# Altium schematic sheet Heater_Driver.SchDoc: Heater Driver Soldeerbout
size A4; Date: 18/02/2022; Author: Robbe Th.; CompanyName: R-CyberSolutions; DrawnBy: Robbe Th.; Organization: R-CyberSolutions; DocumentNumber: 1/1; Revision: 1; SheetNumber: 2; SheetTotal: 4; Number: PXL_SEM2_SB02R1
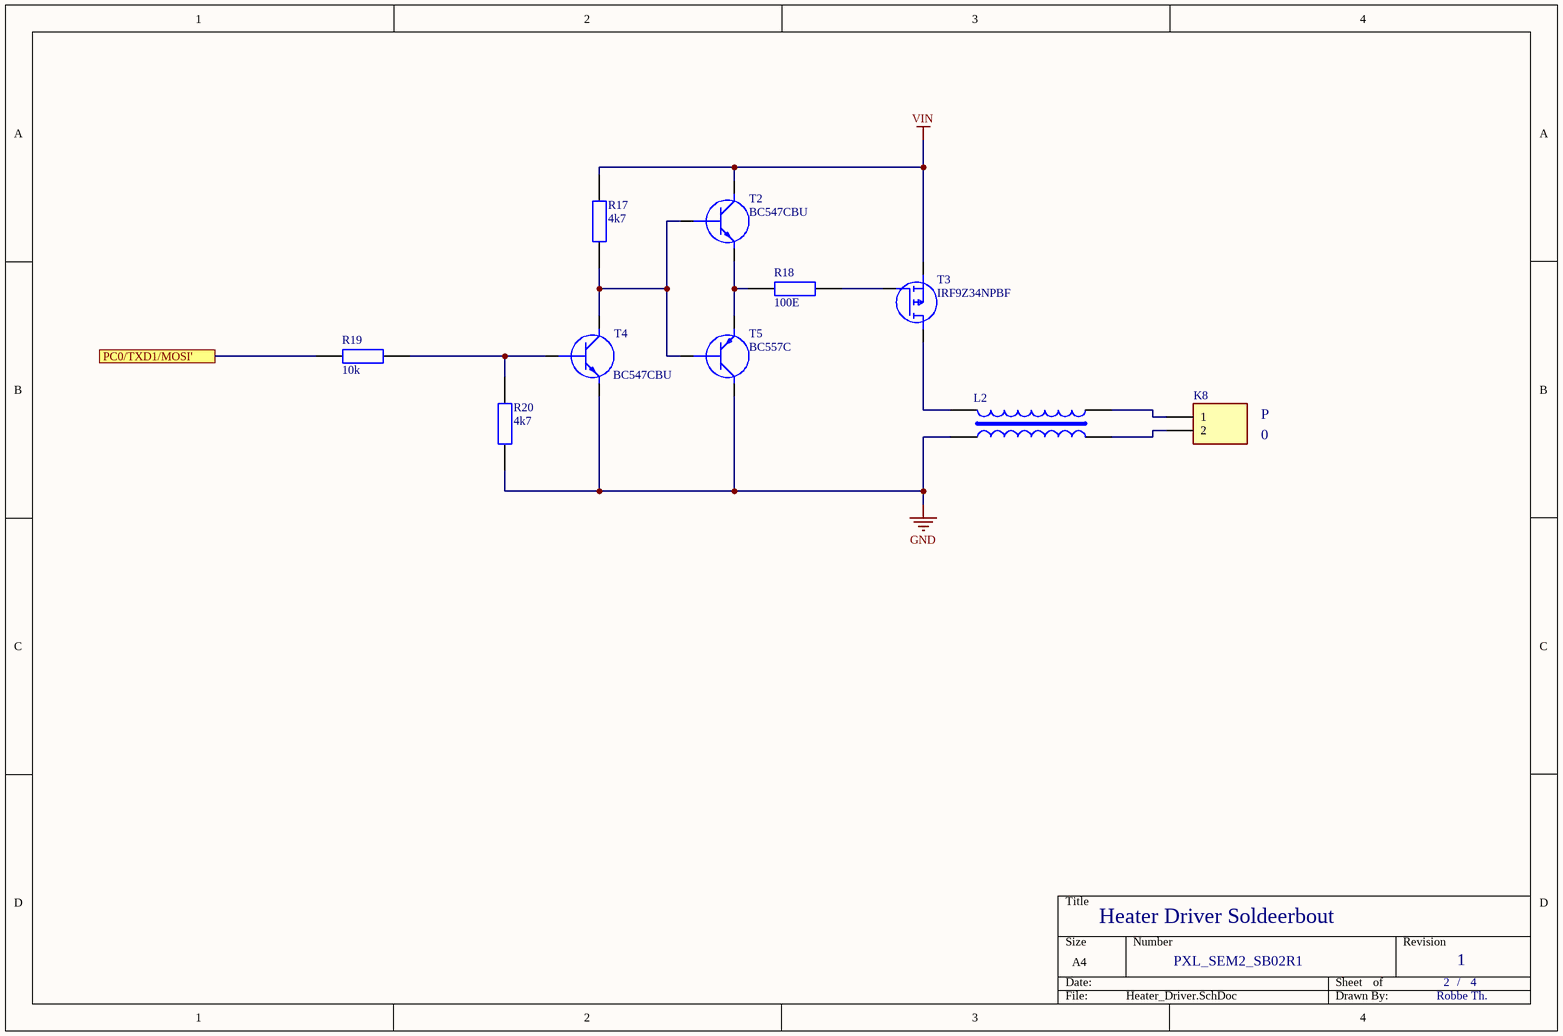
[diagram p0: Heater_Driver.SchDoc]

## Parts
K8  Printkroonsteen 2 POL  [1716020000]  (value not drawn)
L2  CM2545X171B-10  [CM2545X171B10]  (value not drawn)
R17  4k7  [RESC2012X65N]
R18  100E  [RESC2012X65N]
R19  10k  [RESC2012X65N]
R20  4k7  [RESC2012X65N]
T2  BC547CBU  [BC547CBU]
T3  IRF9Z34NPBF  [TO254P469X1042X1967-3P]
T4  BC547CBU  [BC547CBU]
T5  BC557C  [BC557C]

## Ports
PC0/TXD1/MOSI'

## Nets
GND: L2.2(SEC+) R20.1 T4.3(E) T5.3(C)
VIN: R17.2 T2.1(C) T3.2(S)
PC0/TXD1/MOSI': R19.1 ; port PC0/TXD1/MOSI'
NetK8_1: K8.1 L2.4(PRI-)
NetK8_2: K8.2 L2.3(SEC-)
NetL2_1: L2.1(PRI+) T3.3(D)
NetR17_1: R17.1 T2.2(B) T4.1(C) T5.2(B)
NetR18_1: R18.1 T2.3(E) T5.1(E)
NetR18_2: R18.2 T3.1(G)
NetR19_2: R19.2 R20.2 T4.2(B)

## Notes on the sheet
- P
- 0
- /

## Library data of the parts
K8 = 1716020000: Manufacturer_Name: Weidmuller; Datasheet Link: https://catalog.weidmueller.com/catalog/Start.do?ObjectID=1716020000&_ga=2.21797499.1716783809.1613378202-511725545.1613378202; Manufacturer_Part_Number: 1716020000; Mouser Part Number: 470-1716020000; Mouser Price/Stock: https://www.mouser.co.uk/ProductDetail/Weidmuller/1716020000?qs=WJDKaGZ8K%252B7GSEFQgvMjVA%3D%3D
L2 = CM2545X171B-10: Common mode smoorspoel 10A; Manufacturer_Name: Laird Technologies; Datasheet Link: https://datasheet.datasheetarchive.com/originals/dk/DKDS-7/122753.pdf; Height: 9.5mm; Manufacturer_Part_Number: CM2545X171B-10; Mouser Part Number: N/A; Mouser Price/Stock: https://www.mouser.co.uk/ProductDetail/Laird/CM2545X171B-10?qs=PzGy0jfpSMtNfkEypgU65A%3D%3D; Arrow Part Number: CM2545X171B-10; Arrow Price/Stock: https://www.arrow.com/en/products/cm2545x171b-10/laird-technologies
R17-R20 = CPF0805B100RE1: Resistor SMD 0805; Manufacturer_Name: TE Connectivity; Datasheet Link: https://datasheet.datasheetarchive.com/originals/distributors/DKDS-21/401696.pdf; Height: 0.65mm; Manufacturer_Part_Number: CPF0805B100RE1; Mouser Part Number: 279-CPF0805B100RE1; Mouser Price/Stock: https://www.mouser.co.uk/ProductDetail/TE-Connectivity-Holsworthy/CPF0805B100RE1?qs=9ylKvqdyudkCWLPT1QvLZQ%3D%3D; Arrow Part Number: CPF0805B100RE1; Arrow Price/Stock: https://www.arrow.com/en/products/cpf0805b100re1/te-connectivity?region=nac
T2 T4 = BC547CBU: Transistor BJT NPN; Manufacturer_Name: ON Semiconductor; Datasheet Link: https://www.onsemi.com/pdf/datasheet/bc550-d.pdf; Height: 5.33mm; Manufacturer_Part_Number: BC547CBU; Mouser Part Number: 512-BC547CBU; Mouser Price/Stock: https://www.mouser.co.uk/ProductDetail/ON-Semiconductor-Fairchild/BC547CBU/?qs=SpPkH8nd0tbX52Pj0mX5Aw%3D%3D; Arrow Part Number: BC547CBU; Arrow Price/Stock: https://www.arrow.com/en/products/bc547cbu/on-semiconductor?region=nac
T3 = IRF9Z34NPBF: MOSFET (P-Channel); Manufacturer_Name: Infineon; Datasheet Link: https://www.infineon.com/dgdl/irf9z34npbf.pdf?fileId=5546d462533600a40153561220af1ddd; Height: 4.69mm; Manufacturer_Part_Number: IRF9Z34NPBF; Mouser Part Number: 942-IRF9Z34NPBF; Mouser Price/Stock: https://www.mouser.co.uk/ProductDetail/Infineon-IR/IRF9Z34NPBF?qs=9%252BKlkBgLFf16a%2FvlD%252BMCtQ%3D%3D; Arrow Part Number: IRF9Z34NPBF; Arrow Price/Stock: https://www.arrow.com/en/products/irf9z34npbf/infineon-technologies-ag?region=nac
T5 = BC557C: Transistor BJT PNP; Manufacturer_Name: NXP; Datasheet Link: http://uk.rs-online.com/web/p/products/1124775; Height: 5.2mm; Manufacturer_Part_Number: BC557C; Mouser Part Number: 771-BC557C; Mouser Price/Stock: https://www.mouser.co.uk/ProductDetail/NXP-Semiconductors/BC557C?qs=84A%2FDAdkstLO1yR4NjQrgg%3D%3D